# Altium project programmer.PrjPcb
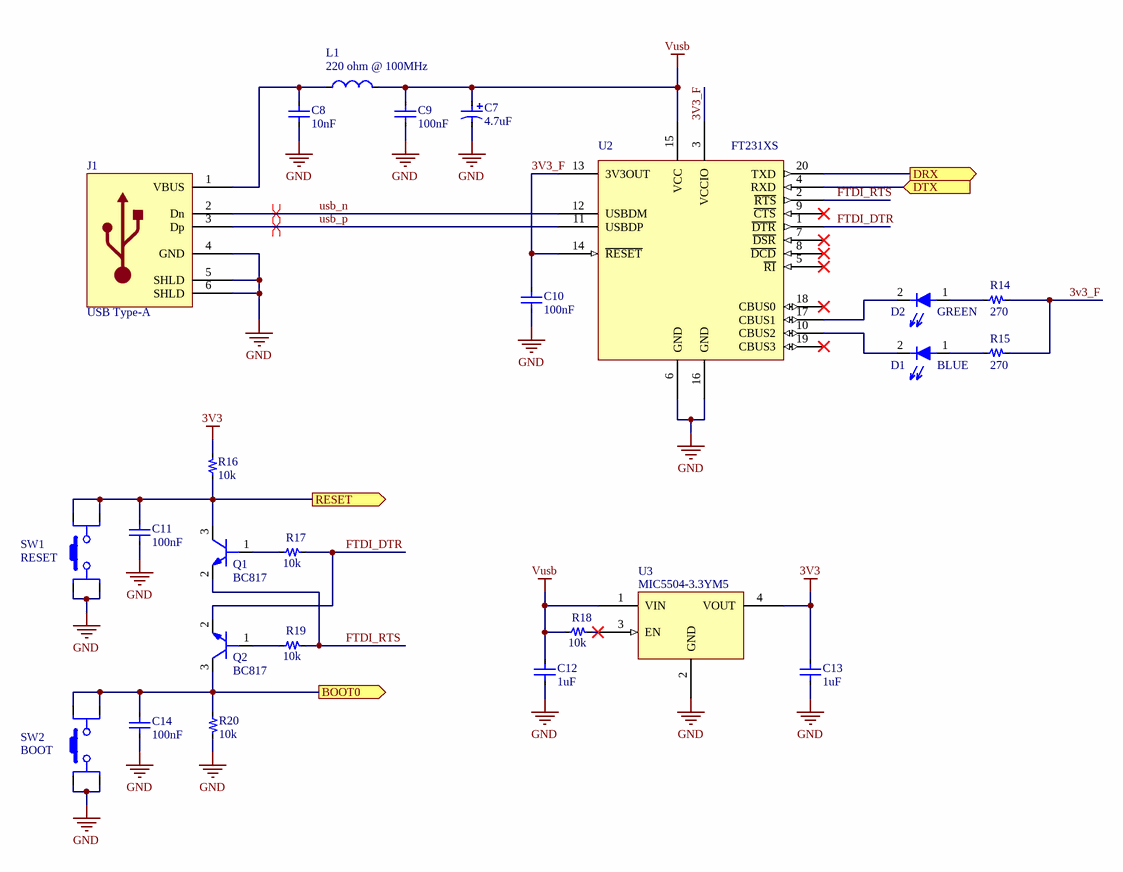
[diagram p0: power.SchDoc]
ProjectTitle: Rusty; ProjectRevision: 0; ProjectPCBRev: A; ProjectLicense: GPL; ProjectDescription: Oxidane module programmer; ProjectDate: 30/05/2018
2 sheets, 44 parts. Net scope: flat (ports and power ports of the same name join across sheets).
Board file: board.PcbDoc
Sheets:
  power.SchDoc
  microcontroller.SchDoc

## Sheet power.SchDoc: Power and Connectors
size A4; Author: Pietro Lorefice; DocumentNumber: 1; Revision: A; SheetNumber: 1; SheetTotal: 3

### Parts
C7  4.7uF  [0603_[1608]]
C8  10nF  [0402_[1005]]
C9  100nF  [0402_[1005]]
C10  100nF  [0402_[1005]]
C11  100nF  [0402_[1005]]
C12  1uF  [0603_[1608]]
C13  1uF  [0603_[1608]]
C14  100nF  [0402_[1005]]
D1  GREEN  [0603_[1608]_K2-A1_LED]
D2  BLUE  [0603_[1608]_K2-A1_LED]
J1  USB Type-A  [MOLEX-48037-0001]
L1  220 ohm @ 100MHz  [1206_[3216]]
Q1  BC817  [SOT95P230X110-3N]
Q2  BC817  [SOT95P230X110-3N]
R14  270  [0402_[1005]]
R15  270  [0402_[1005]]
R16  10k  [0402_[1005]]
R17  10k  [0402_[1005]]
R18  10k  [0402_[1005]]
R19  10k  [0402_[1005]]
R20  10k  [0402_[1005]]
SW1  RESET  [EVQP7A]
SW2  BOOT  [EVQP7A]
U2  FT231XS  [SOP64P600X180-20N]
U3  MIC5504-3.3YM5  [SOT95P280X145-5N]

### Ports
BOOT0 (out), DRX (out), DTX (in), RESET (out)

### Nets
3V3: C13.2 R16.2 U3.4(VOUT)
GND: C7.2 C8.1 C9.1 C10.1 C11.1 C12.1 C13.1 C14.1 J1.4(GND) J1.5(SHLD) J1.6(SHLD) R20.2 SW1.1 SW1.3 SW2.1 SW2.3 U2.6(GND) U2.16(GND) U3.2(GND)
Vusb: C7.1 C9.2 C12.2 L1.2 R18.1 U2.15(VCC) U3.1(VIN)
3V3_F: C10.2 R14.2 R15.2 U2.3(VCCIO) U2.13(3V3OUT) U2.14(~{RESET})
BOOT0: C14.2 Q2.3(C) R20.1 SW2.2 SW2.4 ; port BOOT0
DRX: U2.20(TXD) ; port DRX
DTX: U2.4(RXD) ; port DTX
FTDI_DTR: Q2.2(E) R17.2 U2.1(~{DTR})
FTDI_RTS: Q1.2(E) R19.2 U2.2(~{RTS})
RESET: C11.2 Q1.3(C) R16.1 SW1.2 SW1.4 ; port RESET
usb_n: J1.2(Dn) U2.12(USBDM)
usb_p: J1.3(Dp) U2.11(USBDP)
NetC8_2: C8.2 J1.1(VBUS) L1.1
NetD1_1: D1.1(A) R14.1
NetD1_2: D1.2(K) U2.17(CBUS1)
NetD2_1: D2.1(A) R15.1
NetD2_2: D2.2(K) U2.10(CBUS2)
NetQ1_1: Q1.1(B) R17.1
NetQ2_1: Q2.1(B) R19.1
NetR18_2: R18.2 U3.3(EN)

Not connected (* = marked no-connect by the designer): U2 5(~{RI})* 7(~{DSR})* 8(~{DCD})* 9(~{CTS})* 18(CBUS0)* 19(CBUS3)*

### Layout directives
differential pair: usb_n, usb_p

### Notes on the sheet
- Title
- Project
- Size:
- Date:
- A4
- Number:
- Time:
- Revision:
- Sheet
- of
- Author:

### Library data of the parts
C7 = CPOL: Polarized capacitor; Value: 4.7uF
C8-C14 = C: Capacitor
  C8: Value: 10nF
  C9-C11 C14: Value: 100nF
  C12 C13: Value: 1uF
D1 D2 = LED: Light-emitting diode, 2 pins
J1 = USB-A: pin to pad: 5>Z1 6>Z2
L1 = L: Inductor; Value: 220 ohm @ 100MHz
Q1 Q2 = BC817: BJT NPN transistor
R14-R20 = R: Resistor
  R14 R15: Value: 270
  R16-R20: Value: 10k
SW1 SW2 = SW-PB-4P: Switch, push-button, SPST, 4 pins
U2 = FT231x: USB to full-handshake UART IC
U3 = MIC550x: Single 300mA LDO voltage regulator

## Sheet microcontroller.SchDoc: Microcontroller
size A4; Author: Pietro Lorefice; DocumentNumber: 2; Revision: A; SheetNumber: 2; SheetTotal: 3
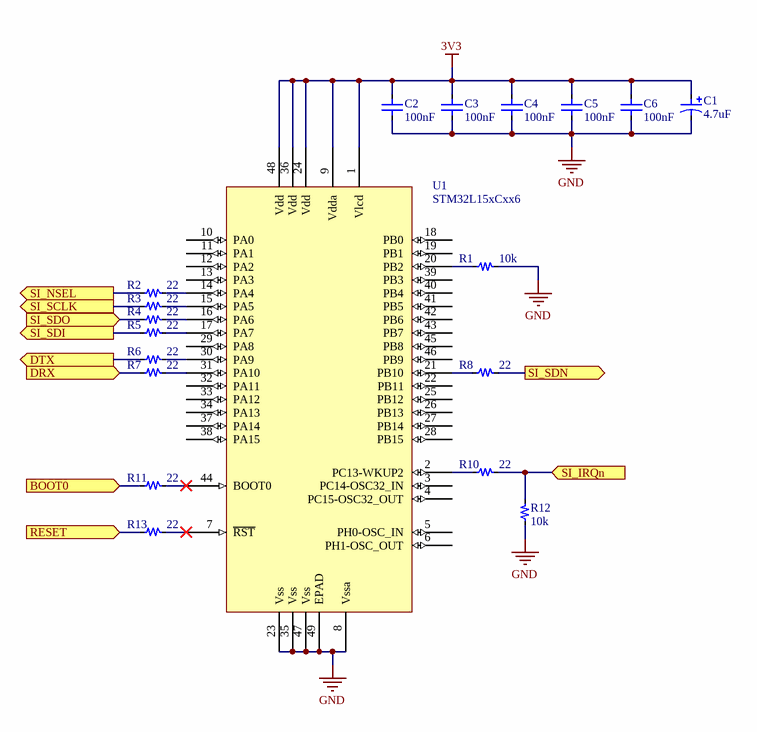
[diagram p1: microcontroller.SchDoc]

### Parts
C1  4.7uF  [0603_[1608]]
C2  100nF  [0402_[1005]]
C3  100nF  [0402_[1005]]
C4  100nF  [0402_[1005]]
C5  100nF  [0402_[1005]]
C6  100nF  [0402_[1005]]
R1  10k  [0402_[1005]]
R2  22  [0402_[1005]]
R3  22  [0402_[1005]]
R4  22  [0402_[1005]]
R5  22  [0402_[1005]]
R6  22  [0402_[1005]]
R7  22  [0402_[1005]]
R8  22  [0402_[1005]]
R10  22  [0402_[1005]]
R11  22  [0402_[1005]]
R12  10k  [0402_[1005]]
R13  22  [0402_[1005]]
U1  STM32L15xCxx6  [QFN50P700X700X60_HS-49N]

### Ports
BOOT0 (in), DRX (in), DTX (out), RESET (in), SI_IRQn (in), SI_NSEL (out), SI_SCLK (out), SI_SDI (out), SI_SDN (out), SI_SDO (in)

### Nets
3V3: C1.1 C2.2 C3.2 C4.2 C5.2 C6.2 U1.1(Vlcd) U1.9(Vdda) U1.24(Vdd) U1.36(Vdd) U1.48(Vdd)
GND: C1.2 C2.1 C3.1 C4.1 C5.1 C6.1 R1.2 R12.1 U1.8(Vssa) U1.23(Vss) U1.35(Vss) U1.47(Vss) U1.49(EPAD)
BOOT0: R11.1 ; port BOOT0
DRX: R7.1 ; port DRX
DTX: R6.1 ; port DTX
RESET: R13.1 ; port RESET
SI_IRQn: R10.2 R12.2 ; port SI_IRQn
SI_NSEL: R2.1 ; port SI_NSEL
SI_SCLK: R3.1 ; port SI_SCLK
SI_SDI: R5.1 ; port SI_SDI
SI_SDN: R8.2 ; port SI_SDN
SI_SDO: R4.1 ; port SI_SDO
NetR1_1: R1.1 U1.20(PB2)
NetR2_2: R2.2 U1.14(PA4)
NetR3_2: R3.2 U1.15(PA5)
NetR4_2: R4.2 U1.16(PA6)
NetR5_2: R5.2 U1.17(PA7)
NetR6_2: R6.2 U1.30(PA9)
NetR7_2: R7.2 U1.31(PA10)
NetR8_1: R8.1 U1.21(PB10)
NetR10_1: R10.1 U1.2(PC13-WKUP2)
NetR11_2: R11.2 U1.44(BOOT0)
NetR13_2: R13.2 U1.7(~{RST})

Not connected (* = marked no-connect by the designer): U1 3(PC14-OSC32_IN) 4(PC15-OSC32_OUT) 5(PH0-OSC_IN) 6(PH1-OSC_OUT) 10(PA0) 11(PA1) 12(PA2) 13(PA3) 18(PB0) 19(PB1) 22(PB11) 25(PB12) 26(PB13) 27(PB14) 28(PB15) 29(PA8) 32(PA11) 33(PA12) 34(PA13) 37(PA14) 38(PA15) 39(PB3) 40(PB4) 41(PB5) 42(PB6) 43(PB7) 45(PB8) 46(PB9)

### Notes on the sheet
- Title
- Project
- Size:
- Date:
- A4
- Number:
- Time:
- Revision:
- Sheet
- of
- Author:

### Library data of the parts
C1 = CPOL: Polarized capacitor; Value: 4.7uF
C2-C6 = C: Capacitor; Value: 100nF
R1-R8 R10-R13 = R: Resistor
  R1 R12: Value: 10k
  R2-R8 R10 R11 R13: Value: 22
U1 = STM32L15xCxx6: Ultra-low-power 32-bit MCU ARM®-based Cortex®-M3, 128KB Flash, 16KB SRAM, 4KB EEPROM, LCD, USB, ADC, DAC

## Nets that join several sheets
3V3: power (C13.2 R16.2 U3.4), microcontroller (11 pins)
GND: power (19 pins), microcontroller (13 pins)
BOOT0: power (5 pins), microcontroller (R11.1)
DRX: power (U2.20), microcontroller (R7.1)
DTX: power (U2.4), microcontroller (R6.1)
RESET: power (5 pins), microcontroller (R13.1)